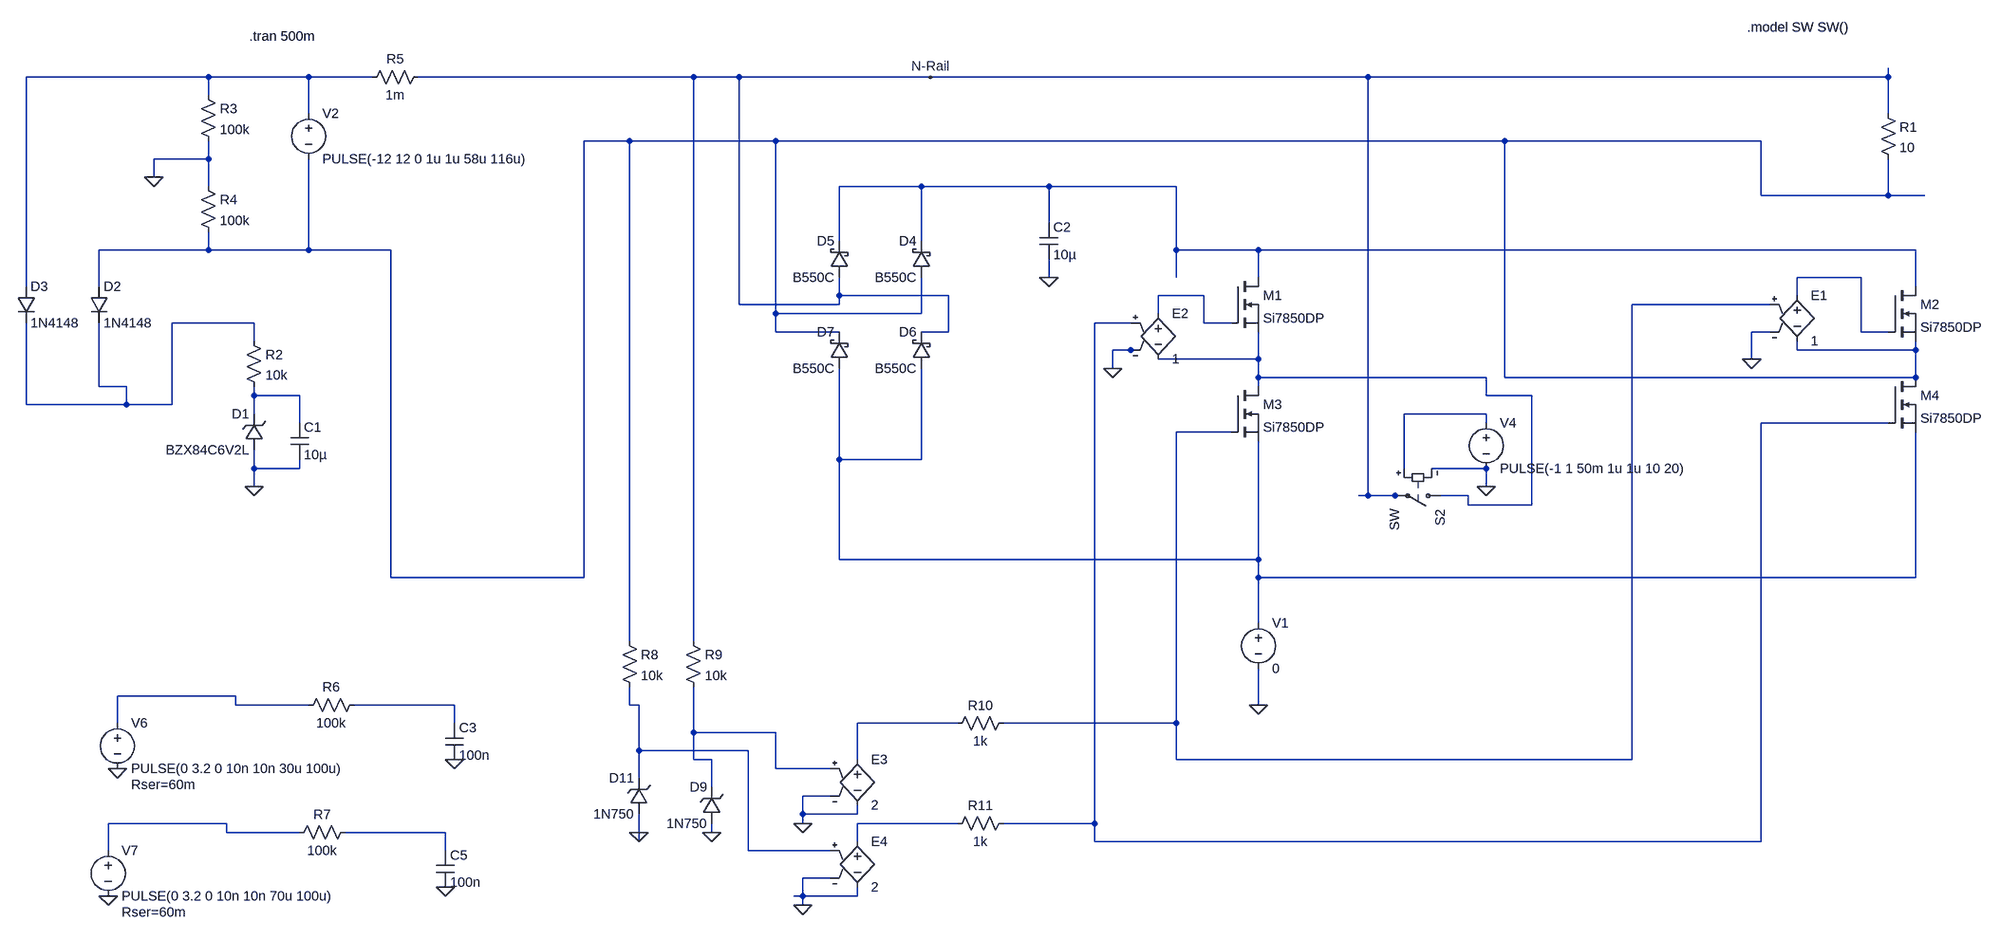
[diagram p0: schematic Tortoise-H-Bridge.asc]
Tortoise-H-Bridge.asc, the LTspice schematic file:
Version 4
SHEET 1 2824 2148
WIRE -2976 -288 -3296 -288
WIRE -2800 -288 -2976 -288
WIRE -2688 -288 -2800 -288
WIRE -1536 -288 -2608 -288
WIRE -1456 -288 -1536 -288
WIRE -1120 -288 -1456 -288
WIRE -352 -288 -1120 -288
WIRE 672 -288 672 -304
WIRE 672 -288 -352 -288
WIRE -2976 -256 -2976 -288
WIRE -2800 -224 -2800 -288
WIRE 672 -224 672 -288
WIRE -1648 -176 -1728 -176
WIRE -1392 -176 -1648 -176
WIRE -112 -176 -1392 -176
WIRE 448 -176 -112 -176
WIRE -2976 -144 -2976 -176
WIRE -2976 -144 -3072 -144
WIRE -3072 -112 -3072 -144
WIRE -2976 -96 -2976 -144
WIRE -1136 -96 -1280 -96
WIRE -912 -96 -1136 -96
WIRE -688 -96 -912 -96
WIRE 448 -80 448 -176
WIRE 672 -80 672 -144
WIRE 672 -80 448 -80
WIRE 736 -80 672 -80
WIRE -912 -32 -912 -96
WIRE -1280 0 -1280 -96
WIRE -1136 0 -1136 -96
WIRE -2976 16 -2976 -16
WIRE -2976 16 -3168 16
WIRE -2800 16 -2800 -144
WIRE -2800 16 -2976 16
WIRE -2656 16 -2800 16
WIRE -688 16 -688 -96
WIRE -544 16 -688 16
WIRE 720 16 -544 16
WIRE -912 64 -912 32
WIRE -688 64 -688 16
WIRE -544 64 -544 16
WIRE 624 64 512 64
WIRE -3296 80 -3296 -288
WIRE -3168 80 -3168 16
WIRE 720 80 720 16
WIRE -1280 96 -1280 64
WIRE -1088 96 -1280 96
WIRE -640 96 -720 96
WIRE 512 96 512 64
WIRE -1456 112 -1456 -288
WIRE -1280 112 -1280 96
WIRE -1280 112 -1456 112
WIRE 464 112 112 112
WIRE -1392 128 -1392 -176
WIRE -1136 128 -1136 64
WIRE -1136 128 -1392 128
WIRE -720 128 -720 96
WIRE -2896 144 -3040 144
WIRE -768 144 -832 144
WIRE -640 144 -640 96
WIRE -592 144 -640 144
WIRE -1392 160 -1392 128
WIRE -1280 160 -1392 160
WIRE -1088 160 -1088 96
WIRE -1088 160 -1136 160
WIRE 464 160 432 160
WIRE 624 160 624 64
WIRE 672 160 624 160
WIRE -2896 176 -2896 144
WIRE -768 192 -800 192
WIRE -752 192 -768 192
WIRE 512 192 512 176
WIRE 720 192 720 176
WIRE 720 192 512 192
WIRE -544 208 -544 160
WIRE -544 208 -720 208
WIRE 432 208 432 160
WIRE -800 224 -800 192
WIRE -544 240 -544 208
WIRE -144 240 -544 240
WIRE -112 240 -112 -176
WIRE 720 240 720 192
WIRE 720 240 -112 240
WIRE -3168 256 -3168 144
WIRE -3120 256 -3168 256
WIRE -544 256 -544 240
WIRE -2896 272 -2896 256
WIRE -2816 272 -2896 272
WIRE -144 272 -144 240
WIRE -64 272 -144 272
WIRE -3296 288 -3296 144
WIRE -3120 288 -3120 256
WIRE -3120 288 -3296 288
WIRE -3040 288 -3040 144
WIRE -3040 288 -3120 288
WIRE -2896 304 -2896 272
WIRE -144 304 -288 304
WIRE -2816 320 -2816 272
WIRE -144 320 -144 304
WIRE 672 320 448 320
WIRE -592 336 -688 336
WIRE -1280 384 -1280 224
WIRE -1136 384 -1136 224
WIRE -1136 384 -1280 384
WIRE -2896 400 -2896 368
WIRE -2816 400 -2816 384
WIRE -2816 400 -2896 400
WIRE -288 400 -288 304
WIRE -144 400 -240 400
WIRE -2896 432 -2896 400
WIRE -144 432 -144 400
WIRE -352 448 -352 -288
WIRE -352 448 -368 448
WIRE -304 448 -352 448
WIRE -288 448 -304 448
WIRE -176 448 -224 448
WIRE -176 464 -176 448
WIRE -64 464 -64 272
WIRE -64 464 -176 464
WIRE -1280 560 -1280 384
WIRE -544 560 -544 352
WIRE -544 560 -1280 560
WIRE -2656 592 -2656 16
WIRE -1728 592 -1728 -176
WIRE -1728 592 -2656 592
WIRE -544 592 -544 560
WIRE 720 592 720 336
WIRE 720 592 -544 592
WIRE -544 672 -544 592
WIRE -1648 704 -1648 -176
WIRE -1536 704 -1536 -288
WIRE -2928 800 -3136 800
WIRE -2928 816 -2928 800
WIRE -2800 816 -2928 816
WIRE -2544 816 -2720 816
WIRE -1648 816 -1648 784
WIRE -1632 816 -1648 816
WIRE -544 816 -544 752
WIRE -3136 848 -3136 800
WIRE -2544 848 -2544 816
WIRE -1072 848 -1248 848
WIRE -688 848 -688 336
WIRE -688 848 -992 848
WIRE -1536 864 -1536 784
WIRE -1392 864 -1536 864
WIRE -1632 896 -1632 816
WIRE -1440 896 -1632 896
WIRE -1536 912 -1536 864
WIRE -1504 912 -1536 912
WIRE -1248 912 -1248 848
WIRE -688 912 -688 848
WIRE 112 912 112 112
WIRE 112 912 -688 912
WIRE -1392 928 -1392 864
WIRE -1296 928 -1392 928
WIRE -1632 944 -1632 896
WIRE -1504 960 -1504 912
WIRE -1296 976 -1344 976
WIRE -1344 1008 -1344 976
WIRE -1248 1008 -1248 992
WIRE -1248 1008 -1344 1008
WIRE -2944 1024 -3152 1024
WIRE -1344 1024 -1344 1008
WIRE -1072 1024 -1248 1024
WIRE -832 1024 -832 144
WIRE -832 1024 -992 1024
WIRE -2944 1040 -2944 1024
WIRE -2816 1040 -2944 1040
WIRE -2560 1040 -2736 1040
WIRE -1632 1040 -1632 1008
WIRE -1504 1040 -1504 1024
WIRE -1632 1056 -1632 1040
WIRE -1248 1056 -1248 1024
WIRE -832 1056 -832 1024
WIRE 448 1056 448 320
WIRE 448 1056 -832 1056
WIRE -3152 1072 -3152 1024
WIRE -2560 1072 -2560 1040
WIRE -1440 1072 -1440 896
WIRE -1296 1072 -1440 1072
WIRE -1296 1120 -1344 1120
WIRE -1344 1152 -1344 1120
WIRE -1344 1152 -1360 1152
WIRE -1248 1152 -1248 1136
WIRE -1248 1152 -1344 1152
WIRE -1344 1168 -1344 1152
FLAG -3072 -112 0
FLAG -144 432 0
FLAG -1120 -288 N-Rail
FLAG -2896 432 0
FLAG -2544 912 0
FLAG -3136 928 0
FLAG -2560 1136 0
FLAG -3152 1152 0
FLAG -800 224 0
FLAG -544 816 0
FLAG -912 64 0
FLAG -1632 1040 0
FLAG -1504 1040 0
FLAG 432 208 0
FLAG -1344 1024 0
FLAG -1344 1168 0
SYMBOL nmos -592 64 R0
SYMATTR InstName M1
SYMATTR Value Si7850DP
SYMBOL nmos 672 80 R0
SYMATTR InstName M2
SYMATTR Value Si7850DP
SYMBOL nmos -592 256 R0
SYMATTR InstName M3
SYMATTR Value Si7850DP
SYMBOL nmos 672 240 R0
SYMATTR InstName M4
SYMATTR Value Si7850DP
SYMBOL voltage -2800 -240 R0
WINDOW 123 0 0 Left 2
WINDOW 39 0 0 Left 2
SYMATTR InstName V2
SYMATTR Value PULSE(-12 12 0 1u 1u 58u 116u)
SYMBOL res 656 -240 R0
SYMATTR InstName R1
SYMATTR Value 10
SYMBOL res -2992 -272 R0
SYMATTR InstName R3
SYMATTR Value 100k
SYMBOL res -2992 -112 R0
SYMATTR InstName R4
SYMATTR Value 100k
SYMBOL voltage -144 304 R0
WINDOW 123 0 0 Left 2
WINDOW 39 0 0 Left 2
SYMATTR InstName V4
SYMATTR Value PULSE(-1 1 50m 1u 1u 10 20)
SYMBOL sw -208 448 R90
SYMATTR InstName S2
SYMBOL res -2592 -304 R90
WINDOW 0 0 56 VBottom 2
WINDOW 3 32 56 VTop 2
SYMATTR InstName R5
SYMATTR Value 1m
SYMBOL zener -2880 368 R180
WINDOW 0 24 64 Left 2
WINDOW 3 24 0 Left 2
SYMATTR InstName D1
SYMATTR Value BZX84C6V2L
SYMATTR Description Diode
SYMATTR Type diode
SYMBOL res -2912 160 R0
SYMATTR InstName R2
SYMATTR Value 10k
SYMBOL diode -3312 80 R0
SYMATTR InstName D3
SYMATTR Value 1N4148
SYMBOL diode -3184 80 R0
SYMATTR InstName D2
SYMATTR Value 1N4148
SYMBOL cap -2832 320 R0
SYMATTR InstName C1
SYMATTR Value 10µ
SYMBOL voltage -3136 832 R0
WINDOW 123 0 0 Left 2
WINDOW 39 24 124 Left 2
SYMATTR SpiceLine Rser=60m
SYMATTR InstName V6
SYMATTR Value PULSE(0 3.2 0 10n 10n 30u 100u)
SYMBOL res -2704 800 R90
WINDOW 0 0 56 VBottom 2
WINDOW 3 32 56 VTop 2
SYMATTR InstName R6
SYMATTR Value 100k
SYMBOL cap -2560 848 R0
SYMATTR InstName C3
SYMATTR Value 100n
SYMBOL voltage -3152 1056 R0
WINDOW 123 0 0 Left 2
WINDOW 39 24 124 Left 2
SYMATTR SpiceLine Rser=60m
SYMATTR InstName V7
SYMATTR Value PULSE(0 3.2 0 10n 10n 70u 100u)
SYMBOL res -2720 1024 R90
WINDOW 0 0 56 VBottom 2
WINDOW 3 32 56 VTop 2
SYMATTR InstName R7
SYMATTR Value 100k
SYMBOL cap -2576 1072 R0
SYMATTR InstName C5
SYMATTR Value 100n
SYMBOL schottky -1120 64 R180
WINDOW 0 24 64 Left 2
WINDOW 3 24 0 Left 2
SYMATTR InstName D4
SYMATTR Value B550C
SYMATTR Description Diode
SYMATTR Type diode
SYMBOL schottky -1264 64 R180
WINDOW 0 24 64 Left 2
WINDOW 3 24 0 Left 2
SYMATTR InstName D5
SYMATTR Value B550C
SYMATTR Description Diode
SYMATTR Type diode
SYMBOL e 512 80 R0
SYMATTR InstName E1
SYMATTR Value 1
SYMBOL e -720 112 R0
SYMATTR InstName E2
SYMATTR Value 1
SYMBOL schottky -1120 224 R180
WINDOW 0 24 64 Left 2
WINDOW 3 24 0 Left 2
SYMATTR InstName D6
SYMATTR Value B550C
SYMATTR Description Diode
SYMATTR Type diode
SYMBOL schottky -1264 224 R180
WINDOW 0 24 64 Left 2
WINDOW 3 24 0 Left 2
SYMATTR InstName D7
SYMATTR Value B550C
SYMATTR Description Diode
SYMATTR Type diode
SYMBOL cap -928 -32 R0
SYMATTR InstName C2
SYMATTR Value 10µ
SYMBOL zener -1488 1024 R180
WINDOW 0 24 64 Left 2
WINDOW 3 24 0 Left 2
SYMATTR InstName D9
SYMATTR Value 1N750
SYMBOL zener -1616 1008 R180
WINDOW 0 24 64 Left 2
WINDOW 3 24 0 Left 2
SYMATTR InstName D11
SYMATTR Value 1N750
SYMBOL res -1664 688 R0
SYMATTR InstName R8
SYMATTR Value 10k
SYMBOL res -1552 688 R0
SYMATTR InstName R9
SYMATTR Value 10k
SYMBOL e -1248 896 R0
SYMATTR InstName E3
SYMATTR Value 2
SYMBOL e -1248 1040 R0
SYMATTR InstName E4
SYMATTR Value 2
SYMBOL voltage -544 656 R0
WINDOW 123 0 0 Left 2
WINDOW 39 0 0 Left 2
SYMATTR InstName V1
SYMATTR Value 0
SYMBOL res -976 832 R90
WINDOW 0 0 56 VBottom 2
WINDOW 3 32 56 VTop 2
SYMATTR InstName R10
SYMATTR Value 1k
SYMBOL res -976 1008 R90
WINDOW 0 0 56 VBottom 2
WINDOW 3 32 56 VTop 2
SYMATTR InstName R11
SYMATTR Value 1k
TEXT -2904 -360 Left 2 !.tran 500m
TEXT 424 -376 Left 2 !.model SW SW()

The netlist it stands for:
* Tortoise-H-Bridge.asc
M1 N003 N005 N009 N009 Si7850DP
M2 N003 N004 N002 N002 Si7850DP
M3 N009 N006 N012 N012 Si7850DP
M4 N002 N008 N012 N012 Si7850DP
V2 N001 N002 PULSE(-12 12 0 1u 1u 58u 116u)
R1 N-Rail N002 10
R3 N001 0 100k
R4 0 N002 100k
V4 N011 0 PULSE(-1 1 50m 1u 1u 10 20)
S2 N009 N-Rail N011 0 SW
R5 N-Rail N001 1m
D1 0 N010 BZX84C6V2L
R2 N007 N010 10k
D3 N001 N007 1N4148
D2 N002 N007 1N4148
C1 N010 0 10µ
V6 N013 0 PULSE(0 3.2 0 10n 10n 30u 100u) Rser=60m
R6 N014 N013 100k
C3 N014 0 100n
V7 N018 0 PULSE(0 3.2 0 10n 10n 70u 100u) Rser=60m
R7 N020 N018 100k
C5 N020 0 100n
D4 N002 N003 B550C
D5 N-Rail N003 B550C
E1 N004 N002 N006 0 1
E2 N005 N009 N008 0 1
D6 N012 N-Rail B550C
D7 N012 N002 B550C
C2 N003 0 10µ
D9 0 N017 1N750
D11 0 N015 1N750
R8 N002 N015 10k
R9 N-Rail N017 10k
E3 N016 0 N017 0 2
E4 N019 0 N015 0 2
V1 N012 0 0
R10 N006 N016 1k
R11 N008 N019 1k
.model D D
.lib standard.dio
.model NMOS NMOS
.model PMOS PMOS
.lib standard.mos
.tran 500m
.model SW SW()
.backanno
.end